# EAGLE design BLDC_ESC (EAGLE 9.5.2)
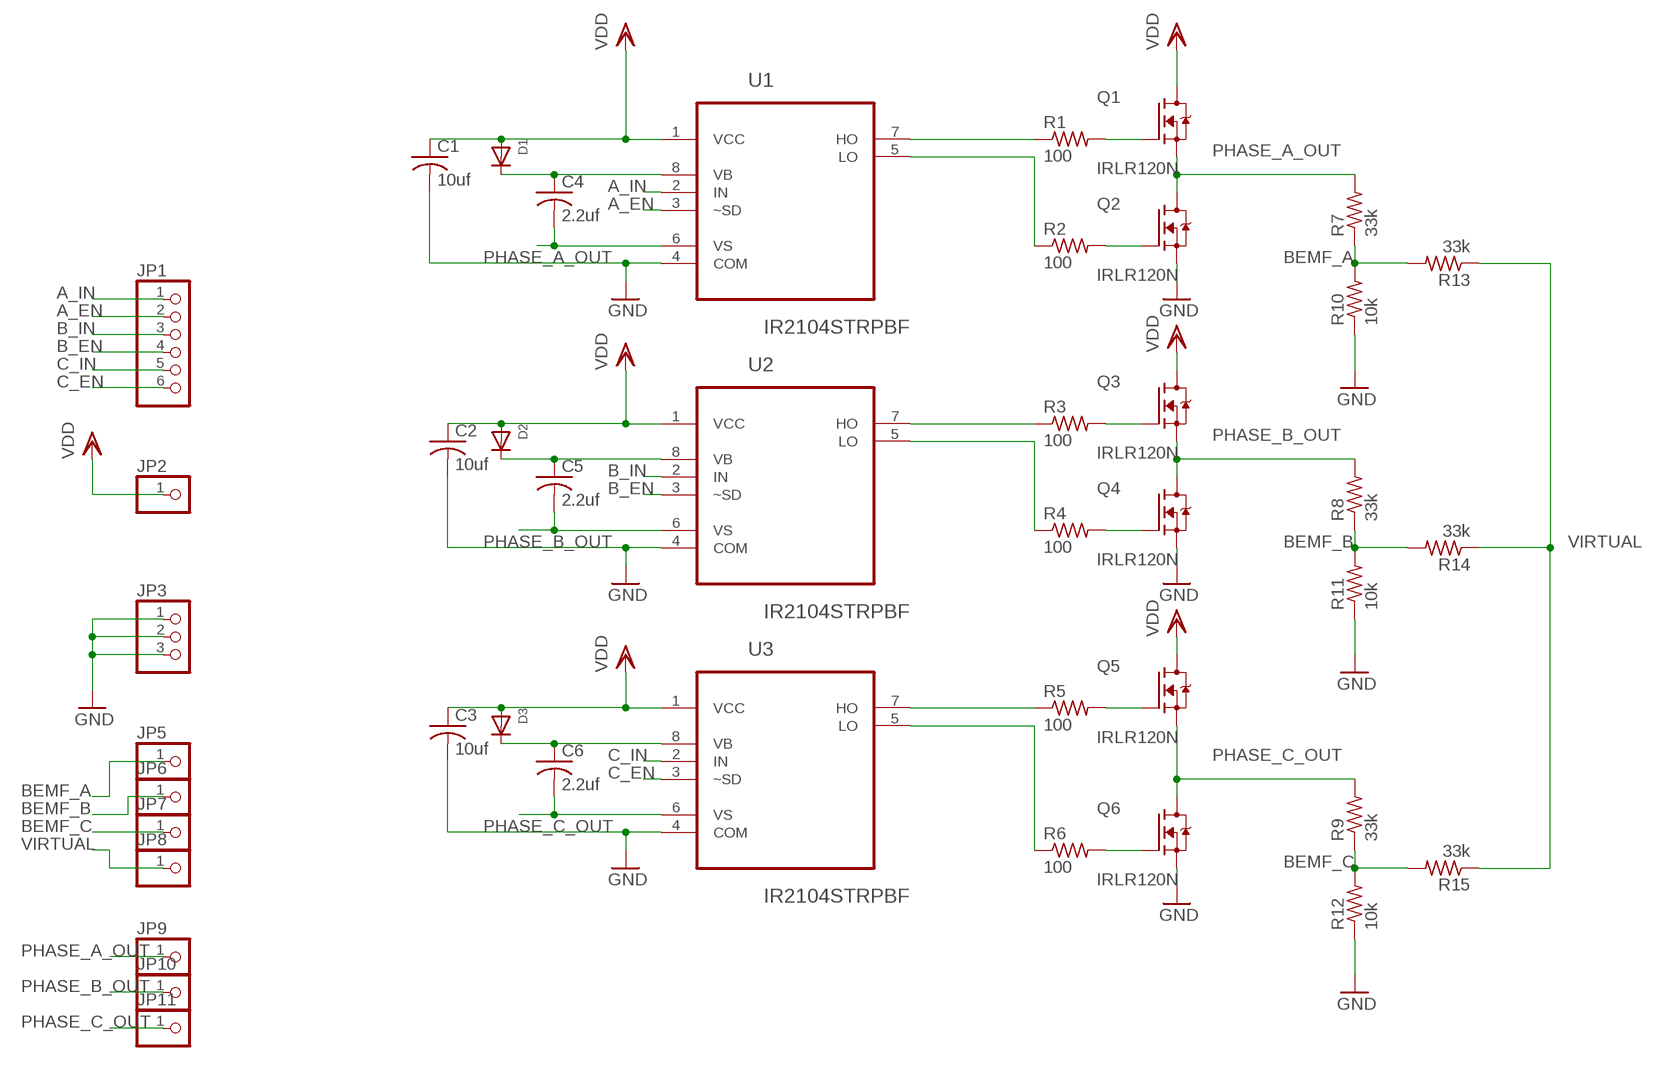
[diagram p0: schematic, sheet 1]

## Parts
C1  10uf  C-USC0805K  [C0805K]
C2  10uf  C-USC0805K  [C0805K]
C3  10uf  C-USC0805K  [C0805K]
C4  2.2uf  C-USC0805K  [C0805K]
C5  2.2uf  C-USC0805K  [C0805K]
C6  2.2uf  C-USC0805K  [C0805K]
D1  DIODESOD-123  [SOD-123]
D2  DIODESOD-123  [SOD-123]
D3  DIODESOD-123  [SOD-123]
JP1  PINHD-1X6  [1X06]
JP2  PINHD-1X1  [1X01]
JP3  PINHD-1X3  [1X03]
JP5  PINHD-1X1  [1X01]
JP6  PINHD-1X1  [1X01]
JP7  PINHD-1X1  [1X01]
JP8  PINHD-1X1  [1X01]
JP9  PINHD-1X1  [1X01]
JP10  PINHD-1X1  [1X01]
JP11  PINHD-1X1  [1X01]
Q1  IRLR120N  [DPAK229P990X239-3N]
Q2  IRLR120N  [DPAK229P990X239-3N]
Q3  IRLR120N  [DPAK229P990X239-3N]
Q4  IRLR120N  [DPAK229P990X239-3N]
Q5  IRLR120N  [DPAK229P990X239-3N]
Q6  IRLR120N  [DPAK229P990X239-3N]
R1  100  R-US_R0805  [R0805]
R2  100  R-US_R0805  [R0805]
R3  100  R-US_R0805  [R0805]
R4  100  R-US_R0805  [R0805]
R5  100  R-US_R0805  [R0805]
R6  100  R-US_R0805  [R0805]
R7  33k  R-US_R0805  [R0805]
R8  33k  R-US_R0805  [R0805]
R9  33k  R-US_R0805  [R0805]
R10  10k  R-US_R0805  [R0805]
R11  10k  R-US_R0805  [R0805]
R12  10k  R-US_R0805  [R0805]
R13  33k  R-US_R0805  [R0805]
R14  33k  R-US_R0805  [R0805]
R15  33k  R-US_R0805  [R0805]
U1  IR2104STRPBF  [SOIC127P600X175-8N]
U2  IR2104STRPBF  [SOIC127P600X175-8N]
U3  IR2104STRPBF  [SOIC127P600X175-8N]

## Nets
A_EN: JP1.2 U1.3(~SD)
A_IN: JP1.1 U1.2(IN)
B_EN: JP1.4 U2.3(~SD)
B_IN: JP1.3 U2.2(IN)
BEMF_A: JP5.1 R7.1 R10.2 R13.2
BEMF_B: JP6.1 R8.1 R11.2 R14.2
BEMF_C: JP7.1 R9.1 R12.2 R15.2
C_EN: JP1.6 U3.3(~SD)
C_IN: JP1.5 U3.2(IN)
GND: C1.2 C2.2 C3.2 JP3.1 JP3.2 JP3.3 Q2.2(S) Q4.2(S) Q6.2(S) R10.1 R11.1 R12.1 U1.4(COM) U2.4(COM) U3.4(COM)
N$1: Q1.1(G) R1.2
N$2: R1.1 U1.7(HO)
N$3: R2.1 U1.5(LO)
N$4: Q2.1(G) R2.2
N$5: C6.1 D3.C U3.8(VB)
N$6: C5.1 D2.C U2.8(VB)
N$7: C4.1 D1.C U1.8(VB)
N$8: R3.1 U2.7(HO)
N$9: Q3.1(G) R3.2
N$10: R4.1 U2.5(LO)
N$11: Q4.1(G) R4.2
N$12: R5.1 U3.7(HO)
N$13: Q5.1(G) R5.2
N$14: R6.1 U3.5(LO)
N$15: Q6.1(G) R6.2
PHASE_A_OUT: C4.2 JP9.1 Q1.2(S) Q2.3(D) R7.2 U1.6(VS)
PHASE_B_OUT: C5.2 JP10.1 Q3.2(S) Q4.3(D) R8.2 U2.6(VS)
PHASE_C_OUT: C6.2 JP11.1 Q5.2(S) Q6.3(D) R9.2 U3.6(VS)
VDD: C1.1 C2.1 C3.1 D1.A D2.A D3.A JP2.1 Q1.3(D) Q3.3(D) Q5.3(D) U1.1(VCC) U2.1(VCC) U3.1(VCC)
VIRTUAL: JP8.1 R13.1 R14.1 R15.1

## Library data of the parts
C1-C6 = adafruit:C-US: CAPACITOR, American symbol
D1-D3 = adafruit:DIODE: Diode SMADIODE - SMA Surface Mount Package 20V 1A Schottky Diode Digikey: 641-1014-6-ND DO-1N4148 - Through Hole Small Current Diode SOD-123 20V 1 A (.5mV Vf) Schottky Diode - Digikey: MBRX120TPMSCT-ND SOD-323 10V 570mA (.38mV Vf, 3ns) Schottky Diode - Digikey: ZLLS410CT-ND SOD-523 30V 30mA Schottky Diode (RB751S-40TE61) - Digikey: RB751S-40TE61CT-ND SOT23-R/W - SOT23 Package (R = Solder Paste/Reflow Ovens, W = Hand-Soldering) BAT54Film 40V 300mA - Digikey: 497-7162-1-ND
JP1 = adafruit:PINHD-1X6: PIN HEADER
JP2 JP5-JP11 = adafruit:PINHD-1X1: Pin header 1x1 for 0.1" spacing With round pins
JP3 = adafruit:PINHD-1X3: PIN HEADER
Q1-Q6 = IRLR120N:IRLR120N: 100V Single N-Channel HEXFET Power MOSFET in a D-Pak package; DESCRIPTION: 100V Single N-Channel HEXFET Power MOSFET in a D-Pak package; DIGI-KEY_PART_NUMBER: IRLR120NPBFCT-ND; DIGI-KEY_PURCHASE_URL: https://www.digikey.com/product-detail/en/infineon-technologies/IRLR120NTRPBF/IRLR120NPBFCT-ND/812548?utm_source=snapeda&utm_medium=aggregator&utm_campaign=symbol; MF: Infineon Technologies; MP: IRLR120N; PACKAGE: TO-252 International Rectifier
R1-R15 = adafruit:R-US_: RESISTOR, American symbol
U1-U3 = IR2104STRPBF:IR2104STRPBF: HALF-BRIDGE DRIVER; DESCRIPTION: Half Bridge Driver, Single Input Plus Inverting Shutdown Pin, Fixed 520ns Deadtime in a 8-Lead package; DIGI-KEY_PART_NUMBER: IR2104SPBFCT-ND; DIGI-KEY_PURCHASE_URL: https://www.digikey.com/product-detail/en/infineon-technologies/IR2104STRPBF/IR2104SPBFCT-ND/812609?utm_source=snapeda&utm_medium=aggregator&utm_campaign=symbol; MF: Infineon Technologies; MP: IR2104STRPBF; PACKAGE: SOIC-8 Infineon

## Board
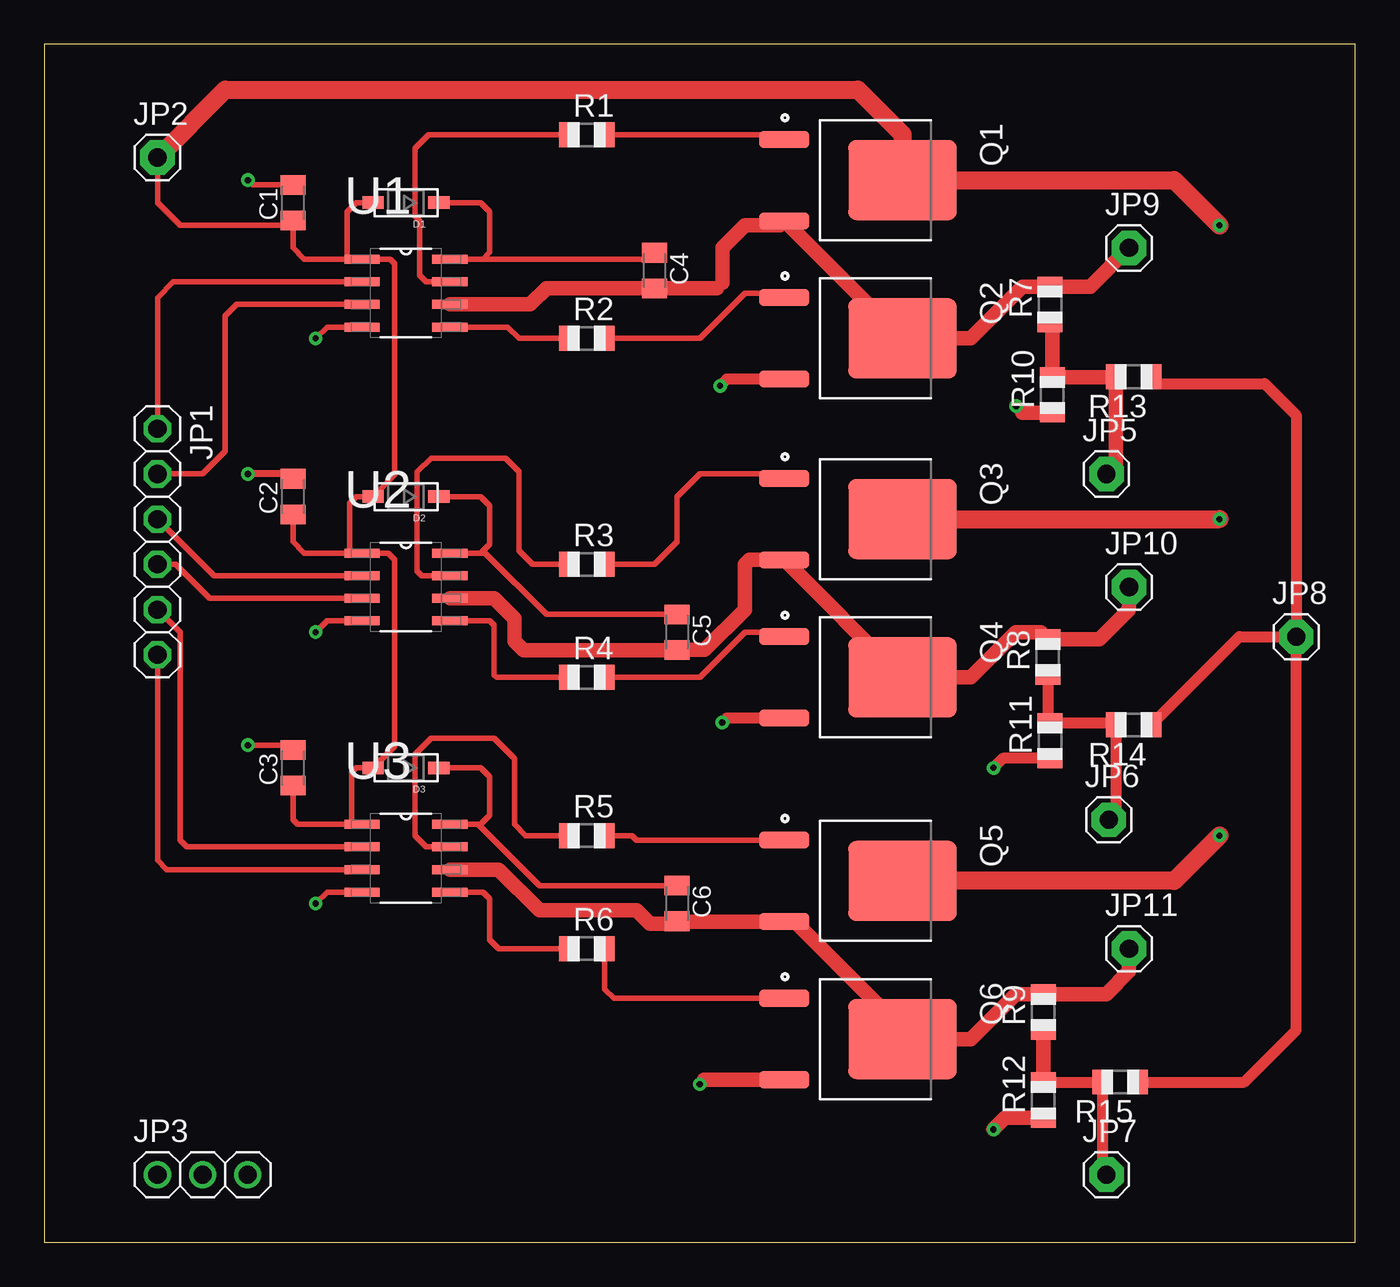
[diagram p1: board, top side]
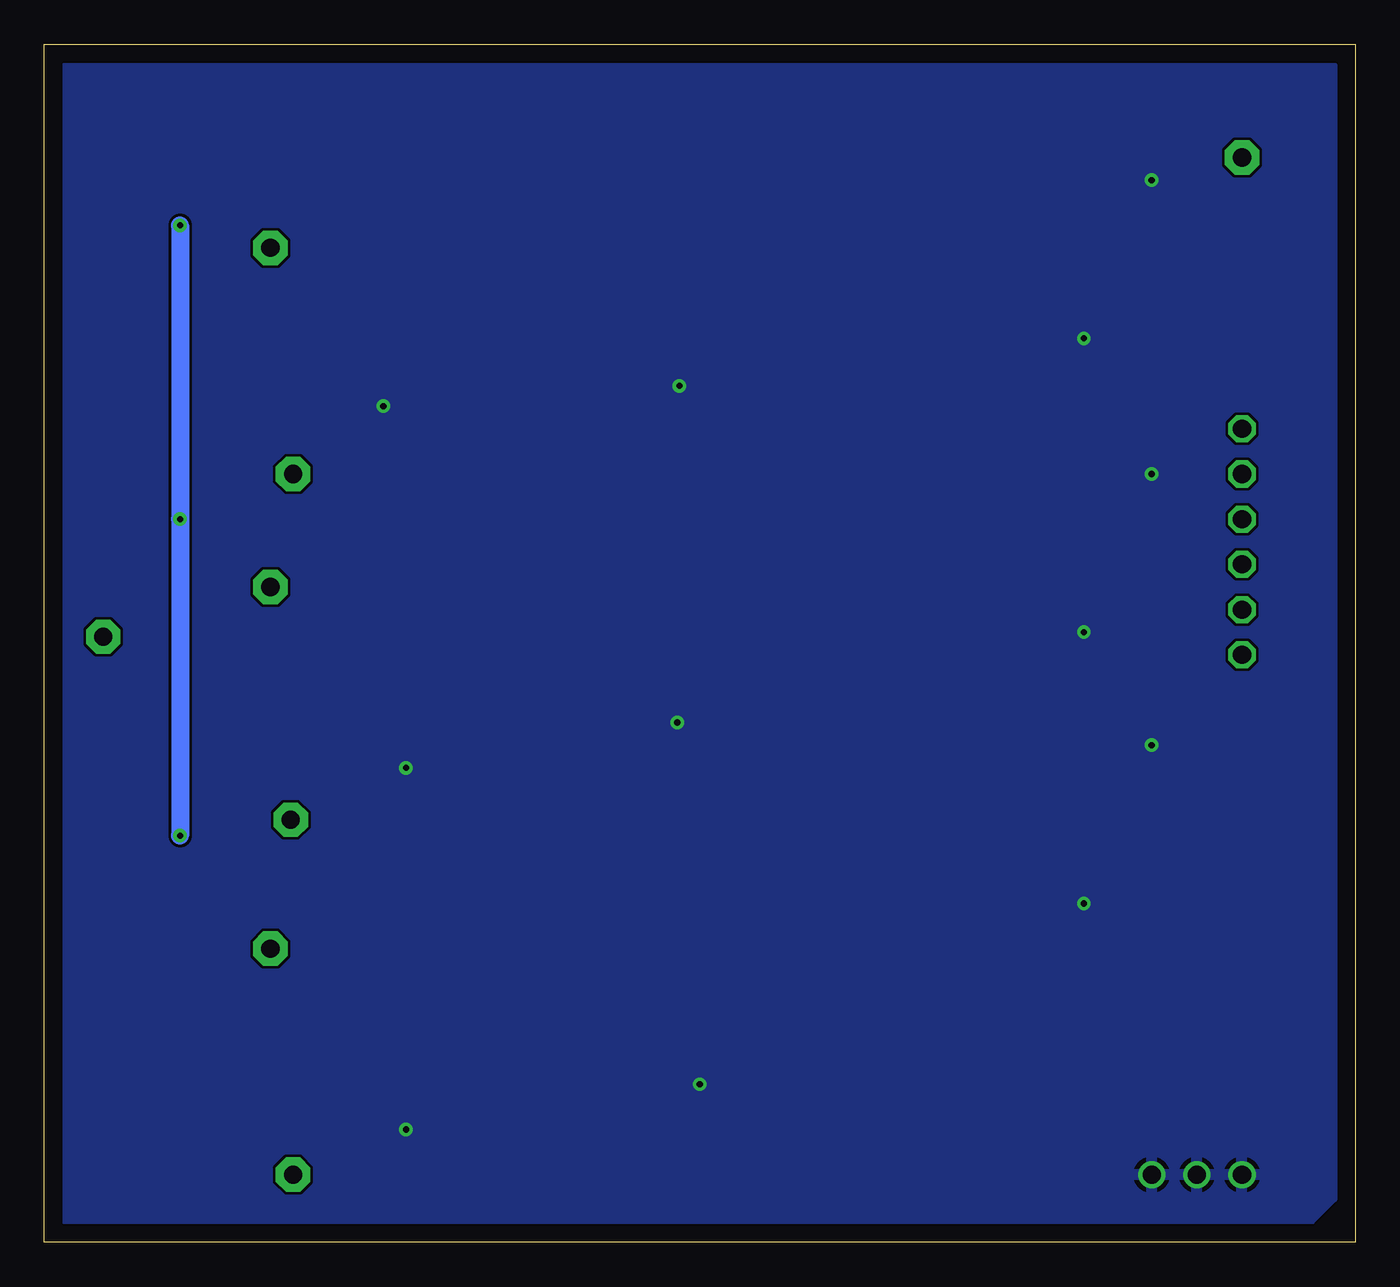
[diagram p2: board, bottom side, seen from below]

Size 73.66 x 67.31 mm. Coordinates in mm from the lower left corner, seen from the top.
Outline: 0,0 73.66,0 73.66,67.31 0,67.31 0,0
Copper layers (1*16): Top 0.035mm / dielectric 1.5mm / Bottom 0.035mm
Design rules "default": minimum track width 6mil, minimum drill 0.35mm, track to track 6mil, track to pad 6mil, pad to pad 6mil, via to via 6mil, smd to smd 6mil, copper to edge 40mil, drill to drill 6mil, minimum pad ring 10mil, minimum via ring 8mil, stop-mask expansion 4mil, vias tented up to drill 0mil, thermal gap 10mil

### Footprints (pad centres in the part's own frame; a part is rotated, then mirrored left to right if it is on the bottom)
C0805K = smd 1.1 x 1.4: 1 -1,0; 2 1,0
SOD-123 = smd 1.2 x 0.7: A 1.85,0; C -1.85,0
1X06 = drill 1.016 octagon: 1 -6.35,0; 2 -3.81,0; 3 -1.27,0; 4 1.27,0; 5 3.81,0; 6 6.35,0
1X01 = drill 1.016 pad 1.93 octagon: 1 0,0
1X03 = drill 1.016: 1 -2.54,0; 2 0,0; 3 2.54,0
DPAK229P990X239-3N = smd 0.97 x 2.83: 1 -2.29,-4.14; 2 2.29,-4.14 | smd 4.49 x 6.1: 3 0,2.51
R0805 = smd 1.1 x 1.4: 1 -1,0; 2 1,0
SOIC127P600X175-8N = smd 1.981 x 0.508: 1 -2.464,1.905; 2 -2.464,0.635; 3 -2.464,-0.635; 4 -2.464,-1.905; 5 2.464,-1.905; 6 2.464,-0.635; 7 2.464,0.635; 8 2.464,1.905

### Placement (x,y rotation side)
C1  13.97,58.42 90 top
C2  13.97,41.91 90 top
C3  13.97,26.67 90 top
C4  34.29,54.61 270 top
C5  35.56,34.29 270 top
C6  35.56,19.05 270 top
D1  20.32,58.42 180 top
D2  20.32,41.91 180 top
D3  20.32,26.67 180 top
JP1  6.35,39.37 270 top
JP2  6.35,60.96 0 top
JP3  8.89,3.81 0 top
JP5  59.69,43.18 0 top
JP6  59.82,23.75 0 top
JP7  59.69,3.81 0 top
JP8  70.36,34.04 0 top
JP9  60.96,55.88 0 top
JP10  60.96,36.83 0 top
JP11  60.96,16.51 0 top
Q1  45.72,59.69 270 top
Q2  45.72,50.8 270 top
Q3  45.72,40.64 270 top
Q4  45.72,31.75 270 top
Q5  45.72,20.32 270 top
Q6  45.72,11.43 270 top
R1  30.48,62.23 0 top
R2  30.48,50.8 0 top
R3  30.48,38.1 0 top
R4  30.48,31.75 0 top
R5  30.48,22.86 0 top
R6  30.48,16.51 0 top
R7  56.52,52.7 90 top
R8  56.39,32.89 90 top
R9  56.13,12.95 90 top
R10  56.64,47.62 90 top
R11  56.52,28.19 90 top
R12  56.13,8 90 top
R13  61.21,48.64 180 top
R14  61.21,29.08 180 top
R15  60.45,9.02 180 top
U1  20.32,53.34 0 top
U2  20.32,36.83 0 top
U3  20.32,21.59 0 top

### Tracks (layer width: path | path; a pad name or v marks a point on that pad's centre or on a via)
A_EN
  Top 0.305: JP1.2 8.89,43.18 10.16,44.45 10.16,52.07 10.79,52.7 U1.3
A_IN
  Top 0.305: JP1.1 6.35,53.09 7.24,53.98 U1.2
B_EN
  Top 0.305: JP1.4 7.37,38.1 9.27,36.2 U2.3
B_IN
  Top 0.305: U2.2 9.53,37.47 JP1.3
BEMF_A
  Top 0.61: R7.1 56.64,51.58 | R13.2 60.2,48.62 | 60.21,43.7 JP5.1
  Top 0.813: 56.64,51.58 R10.2 60.2,48.62 | R13.2 60.21,43.7
BEMF_B
  Top 0.61: R8.1 56.39,29.32 R11.2 60.1,29.19 R14.2 60.21,24.15 JP6.1
BEMF_C
  Top 0.61: R12.2 59.44,9 R15.2 59.45,4.05 JP7.1
  Top 0.813: R9.1 R12.2
C_EN
  Top 0.305: U3.3 6.86,20.95 6.35,21.46 JP1.6
C_IN
  Top 0.305: JP1.5 7.62,34.29 7.62,22.61 8,22.23 U3.2
GND  (via drill 0.35)
  Top 0.305: U3.4 15.88,19.68 v15.24,19.05 | 13.7,27.94 v11.43,27.94 | U2.4 15.88,34.92 v15.24,34.29 | U1.4 15.88,51.44 v15.24,50.8 | C1.2 11.7,59.42 v11.43,59.69
  Top 0.406: C2.2 13.7,43.18 v11.43,43.18
  Top 0.508: C3.2 13.7,27.94
  Top 0.61: 37.08,9.14 v36.83,8.89 | Q4.2 38.35,29.46 v38.1,29.21 | R11.1 53.86,27.19 v53.34,26.67 | Q2.2 38.35,48.51 v37.97,48.13 | 54.98,46.62 v54.61,46.99
  Top 0.813: Q6.2 37.08,9.14 | R12.1 53.99,7 v53.34,6.35 | R10.1 54.98,46.62
  pour Bottom: 1.27,2.54 2.54,1.27 72.39,1.27 72.39,66.04 1.27,66.04
N$1
  Top 0.152: Q1.1 41.45,62.18 41.45,62.23
  Top 0.305: 41.33,62.23 Q1.1 | R1.2 41.45,62.23 41.91,62.23
N$2
  Top 0.305: R1.1 21.59,62.23 20.83,61.47 20.83,57.66 21.08,57.4 21.08,54.36 21.46,53.98 U1.7
N$3
  Top 0.305: U1.5 26.04,51.44 26.67,50.8 R2.1
N$4
  Top 0.305: R2.2 36.83,50.8 39.37,53.34 41.33,53.34 Q2.1
N$5
  Top 0.305: D3.C 24.51,26.67 25.02,26.16 25.02,24 24.51,23.5 U3.8 24.38,23.5 27.83,20.05 C6.1
N$6
  Top 0.305: D2.C 24.51,41.91 25.02,41.4 25.02,39.24 24.51,38.73 U2.8 24.77,38.73 28.21,35.29 C5.1
N$7
  Top 0.305: D1.C 24.51,58.42 25.02,57.91 25.02,55.63 24.64,55.24 | 24.64,55.24 U1.8 | 24.64,55.24 33.92,55.24 C4.1
N$8
  Top 0.305: R3.1 27.43,38.1 26.67,38.86 26.67,43.31 25.91,44.07 21.72,44.07 20.95,43.31 20.95,37.72 21.21,37.47 U2.7
N$9
  Top 0.305: R3.2 34.29,38.1 35.56,39.37 35.56,41.91 36.83,43.18 41.33,43.18 Q3.1
N$10
  Top 0.305: U2.5 25.02,34.92 25.27,34.67 25.27,31.88 25.4,31.75 R4.1
N$11
  Top 0.305: R4.2 36.83,31.75 39.37,34.29 41.33,34.29 Q4.1
N$12
  Top 0.305: R5.1 27.05,22.86 26.42,23.5 26.42,27.18 25.27,28.32 21.72,28.32 20.83,27.43 20.83,22.86 21.46,22.23 U3.7
N$13
  Top 0.305: Q5.1 33.27,22.61 33.02,22.86 R5.2
N$14
  Top 0.305: U3.5 24.64,19.68 25.02,19.3 25.02,17.02 25.53,16.51 R6.1
N$15
  Top 0.305: Q6.1 32,13.72 31.48,14.24 R6.2
PHASE_A_OUT
  Top 0.152: Q2.3 48.31,50.9 48.18,50.8
  Top 0.61: 46.99,52.04 Q2.3 | 56.24,53.98 R7.2 55.88,53.7 | 48.18,50.8 Q2.3 | Q2.3 48.26,50.8 | Q1.2 41.33,57.15 | 37.79,53.61 38.1,53.92
  Top 0.813: U1.6 27.3,52.7 28.21,53.61 C4.2 37.79,53.61 | Q1.2 48.18,50.8 | Q2.3 52.07,50.8 54.98,53.7 55.88,53.7 | 41.33,57.15 39.37,57.15 38.1,55.88 38.1,53.92 | JP9.1 58.78,53.7 R7.2
PHASE_B_OUT
  Top 0.305: 35.54,33.27 C5.2
  Top 0.61: Q4.3 48.24,31.73 48.2,31.73 | 55.99,34.29 R8.2
  Top 0.813: U2.6 25.27,36.2 26.42,35.05 26.42,33.78 26.92,33.27 35.54,33.27 | 48.2,31.73 Q3.2 39.62,38.35 39.37,38.1 39.37,35.56 37.1,33.29 C5.2 | Q4.3 52.07,31.75 54.61,34.29 55.99,34.29 | JP10.1 60.96,35.56 59.29,33.89 R8.2
PHASE_C_OUT
  Top 0.152: Q5.2 41.76,18.14 42.15,18.05
  Top 0.305: 35.56,17.78 35.56,17.91 C6.2
  Top 0.61: 48.26,11.46 Q6.3 48.5,11.16 48.5,11.7
  Top 0.813: U3.6 25.53,20.95 27.81,18.67 33.27,18.67 34.04,17.91 35.56,17.91 | 42.15,18.05 48.5,11.7 | Q6.3 52.07,11.43 54.59,13.95 R9.2 59.67,13.95 60.96,15.24 JP11.1 | Q5.2 35.58,18.03 C6.2
VDD  (via drill 0.35)
  Top 0.305: U3.1 17.27,23.5 | 17.27,23.5 14.22,23.5 13.97,23.75 C3.1 | 17.27,23.5 17.27,26.42 17.53,26.67 D3.A 19.68,27.89 19.68,38.35 19.3,38.73 U2.1 17.14,38.73 | 17.14,38.73 14.61,38.73 13.97,39.37 C2.1 | 17.14,38.73 17.14,41.53 17.53,41.91 D2.A 19.68,43.12 19.68,54.99 19.43,55.24 U1.1 17.02,55.24 | 17.02,55.24 14.61,55.24 13.97,55.88 13.97,57.15 | 13.97,57.15 C1.1 | 17.02,55.24 17.02,57.91 17.53,58.42 D1.A | JP2.1 6.35,58.42 7.62,57.15 13.97,57.15
  Top 1.016: JP2.1 10.16,64.77 45.72,64.77 48.23,62.26 Q1.3 63.5,59.69 v66.04,57.15 | v66.04,22.86 63.5,20.32 Q5.3 | Q3.3 v66.04,40.64
  Bottom 1.016: v66.04,57.15 v66.04,40.64 v66.04,22.86
VIRTUAL
  Top 0.61: R13.1 62.59,48.26 68.58,48.26 70.36,46.48 JP8.1 | R14.1 67.17,34.04 JP8.1 | R15.1 67.44,9.02 70.36,11.94 JP8.1

### Text on the board
Top: TODO: PHASE OUT CONNECTORS! / VDD: 40 width